# EAGLE design sanguino (EAGLE 5.00)
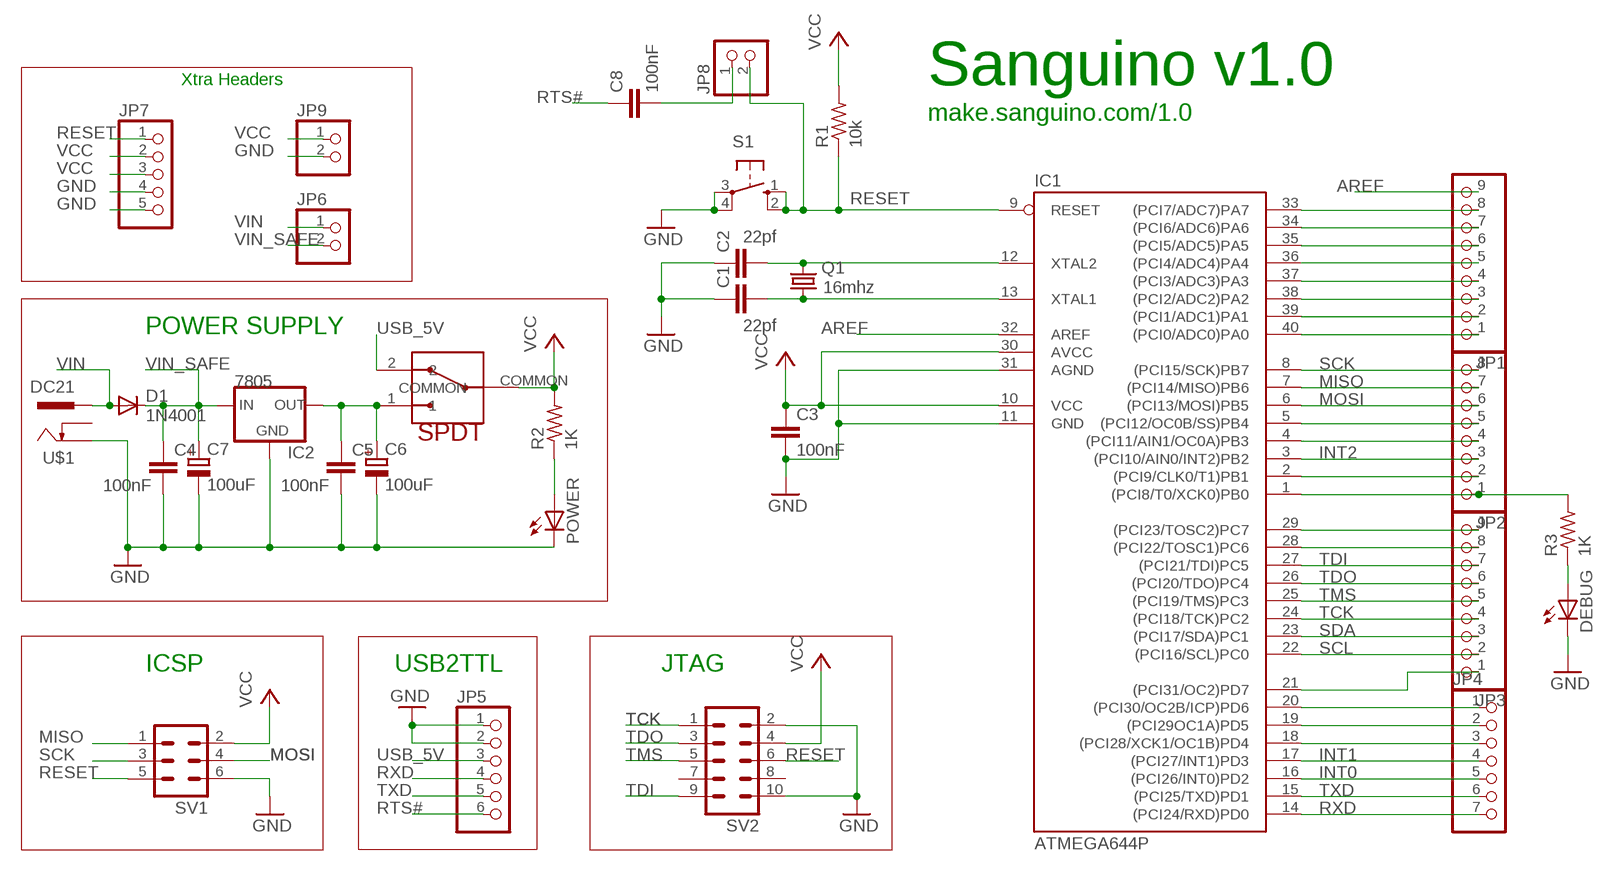
[diagram p0: schematic, sheet 1]

## Parts
C1  22pf  C-EU025-025X050  [C025-025X050]
C2  22pf  C-EU025-025X050  [C025-025X050]
C3  100nF  C-EU050-030X075  [C050-030X075]
C4  100nF  C-EU050-030X075  [C050-030X075]
C5  100nF  C-EU050-030X075  [C050-030X075]
C6  100uF  CPOL-EUE2.5-6  [E2,5-6]
C7  100uF  CPOL-EUE2.5-6  [E2,5-6]
C8  100nF  C-EU050-030X075  [C050-030X075]
D1  1N4001  1N4004  [DO41-10]
DEBUG  LED3MM  [LED3MM]
IC1  ATMEGA644P  ATMEGA644-20P  [DIL40]
IC2  7805  V_REG_78XXSINK  [TO220-IGO]
JP1  PINHD-1X9  [1X09]
JP2  PINHD-1X8  [1X08]
JP3  PINHD-1X9  [1X09]
JP4  PINHD-1X7  [1X07]
JP5  PINHD-1X6  [1X06]
JP6  PINHD-1X2  [1X02]
JP7  PINHD-1X5  [1X05]
JP8  PINHD-1X2  [1X02]
JP9  PINHD-1X2  [1X02]
POWER  LED3MM  [LED3MM]
Q1  16mhz  CRYSTALHC49S  [HC49/S]
R1  10k  R-US_0207/7  [0207/7]
R2  1K  R-US_0207/2V  [0207/2V]
R3  1K  R-US_0207/2V  [0207/2V]
S1  10-XX  [B3F-10XX]
SV1  ML6  [ML6]
SV2  ML10  [ML10]
U$1  DC21  [DCSKT]
U$2  SPDT  [10SP001]

## Nets
AREF: IC1.32(AREF) JP1.9
GND [power]: C1.1 C2.1 C3.2 C4.2 C5.2 C6.- C7.- DEBUG.K(C) IC1.11(GND) IC1.31(AGND) IC2.GND JP5.1 JP5.2 JP7.4 JP7.5 JP9.2 POWER.K(C) S1.3(P) S1.4(P1) SV1.6 SV2.2 SV2.10 U$1.2
INT0: IC1.16((PCI26/INT0)PD2) JP4.5
INT1: IC1.17((PCI27/INT1)PD3) JP4.4
INT2: IC1.3((PCI10/AIN0/INT2)PB2) JP2.3
MISO: IC1.7((PCI14/MISO)PB6) JP2.7 SV1.1
MOSI: IC1.6((PCI13/MOSI)PB5) JP2.6 SV1.4
N$1: C2.2 IC1.12(XTAL2) Q1.2
N$2: IC1.33((PCI7/ADC7)PA7) JP1.8
N$3: IC1.34((PCI6/ADC6)PA6) JP1.7
N$4: POWER.A R2.1
N$5: C1.2 IC1.13(XTAL1) Q1.1
N$6: IC1.35((PCI5/ADC5)PA5) JP1.6
N$7: DEBUG.A R3.1
N$8: IC1.37((PCI3/ADC3)PA3) JP1.4
N$9: IC1.38((PCI2/ADC2)PA2) JP1.3
N$10: IC1.39((PCI1/ADC1)PA1) JP1.2
N$11: IC1.40((PCI0/ADC0)PA0) JP1.1
N$12: IC1.5((PCI12/OC0B/SS)PB4) JP2.5
N$13: IC1.4((PCI11/AIN1/OC0A)PB3) JP2.4
N$15: IC1.2((PCI9/CLK0/T1)PB1) JP2.2
N$16: IC1.1((PCI8/T0/XCK0)PB0) JP2.1 R3.2
N$17: IC1.29((PCI23/TOSC2)PC7) JP3.9
N$18: IC1.28((PCI22/TOSC1)PC6) JP3.8
N$19: IC1.21((PCI31/OC2)PD7) JP3.1
N$20: IC1.36((PCI4/ADC4)PA4) JP1.5
N$21: C8.2 JP8.1
N$22: C5.1 C6.+ IC2.OUT U$2.1
N$26: IC1.20((PCI30/OC2B/ICP)PD6) JP4.1
N$27: IC1.19((PCI29OC1A)PD5) JP4.2
N$28: IC1.18((PCI28/XCK1/OC1B)PD4) JP4.3
RESET: IC1.9(RESET) JP7.1 JP8.2 R1.1 S1.1(S) S1.2(S1) SV1.5 SV2.6
RTS#: C8.1 JP5.6
RXD: IC1.14((PCI24/RXD)PD0) JP4.7 JP5.4
SCK: IC1.8((PCI15/SCK)PB7) JP2.8 SV1.3
SCL: IC1.22((PCI16/SCL)PC0) JP3.2
SDA: IC1.23((PCI17/SDA)PC1) JP3.3
TCK: IC1.24((PCI18/TCK)PC2) JP3.4 SV2.1
TDI: IC1.27((PCI21/TDI)PC5) JP3.7 SV2.9
TDO: IC1.26((PCI20/TDO)PC4) JP3.6 SV2.3
TMS: IC1.25((PCI19/TMS)PC3) JP3.5 SV2.5
TXD: IC1.15((PCI25/TXD)PD1) JP4.6 JP5.5
USB_5V: JP5.3 U$2.2
VCC [power]: C3.1 IC1.10(VCC) IC1.30(AVCC) JP7.2 JP7.3 JP9.1 R1.2 R2.2 SV1.2 SV2.4 U$2.COMMON
VIN [power]: D1.A JP6.1 U$1.1
VIN_SAFE [power]: C4.1 C7.+ D1.C IC2.IN JP6.2
Unconnected: SV2.7 SV2.8 U$1.3

## Notes on the sheet
- Xtra Headers | Sanguino v1.0
- make.sanguino.com/1.0
- POWER SUPPLY
- ICSP | USB2TTL | JTAG

## Library data of the parts
C1-C5 C8 = rcl:C-EU: CAPACITOR, European symbol
C6 C7 = rcl:CPOL-EU: POLARIZED CAPACITOR, European symbol
D1 = diode:1N4004: DIODE general purpose rectifier, 1 A
DEBUG POWER = led:LED: LED OSRAM: - CHIPLED LG R971, LG N971, LY N971, LG Q971, LY Q971, LO R971, LY R971 LH N974, LH R974 LS Q976, LO Q976, LY Q976 LO Q996 - Hyper CHIPLED LW Q18S LB Q993, LB Q99A, LB R99A - SideLED LS A670, LO A670, LY A670, LG A670, LP A670 LB A673, LV A673, LT A673, LW A673 LH A674 LY A675 LS A676, LA A676, LO A676, LY A676, LW A676 LS A679, LY A679, LG A679 - Hyper Micro SIDELED® LS Y876, LA Y876, LO Y876, LY Y876 LT Y87S - SmartLED LW L88C, LW L88S LB L89C, LB L89S, LG L890 LS L89K, LO L89K, LY L89K LS L896, LA L896, LO L896, LY L896 - TOPLED LS T670, LO T670, LY T670, LG T670, LP T670 LSG T670, LSP T670, LSY T670, LOP T670, LYG T670 LG T671, LOG T671, LSG T671 LB T673, LV T673, LT T673, LW T673 LH T674 LS T676, LA T676, LO T676, LY T676, LB T676, LH T676, LSB T676, LW T676 LB T67C, LV T67C, LT T67C, LS T67K, LO T67K, LY T67K, LW E67C LS E67B, LA E67B, LO E67B, LY E67B, LB E67C, LV E67C, LT E67C LW T67C LS T679, LY T679, LG T679 LS T770, LO T770, LY T770, LG T770, LP T770 LB T773, LV T773, LT T773, LW T773 LH T774 LS E675, LA E675, LY E675, LS T675 LS T776, LA T776, LO T776, LY T776, LB T776 LHGB T686 LT T68C, LB T68C - Hyper Mini TOPLED® LB M676 - Mini TOPLED Santana® LG M470 LS M47K, LO M47K, LY M47K Source: http://www.osram.convergy.de - LUMILED® LXK2-PW12-R00, LXK2-PW12-S00, LXK2-PW14-U00, LXK2-PW14-V00 LXK2-PM12-R00, LXK2-PM12-S00, LXK2-PM14-U00 LXK2-PE12-Q00, LXK2-PE12-R00, LXK2-PE12-S00, LXK2-PE14-T00, LXK2-PE14-U00 LXK2-PB12-K00, LXK2-PB12-L00, LXK2-PB12-M00, LXK2-PB14-N00, LXK2-PB14-P00, LXK2-PB14-Q00 LXK2-PR12-L00, LXK2-PR12-M00, LXK2-PR14-Q00, LXK2-PR14-R00 LXK2-PD12-Q00, LXK2-PD12-R00, LXK2-PD12-S00 LXK2-PH12-R00, LXK2-PH12-S00 LXK2-PL12-P00, LXK2-PL12-Q00, LXK2-PL12-R00 Source: www.luxeon.com
IC1 = avr:ATMEGA644*P: MICROCONTROLLER 64 kBytes FLASH 4 kBytes SRAM 2 kBytes EEPROM DUAL USART 8-channel 10 bit ADC
IC2 = SparkFun:V_REG_78XX: Voltage Regulator Standard 7805 5V regulator. IGO (Input Ground Output). Spark Fun Electronics SKU : COM-00107
JP1 JP3 = pinhead:PINHD-1X9: PIN HEADER
JP2 = pinhead:PINHD-1X8: PIN HEADER
JP4 = pinhead:PINHD-1X7: PIN HEADER
JP5 = pinhead:PINHD-1X6: PIN HEADER
JP6 JP8 JP9 = pinhead:PINHD-1X2: PIN HEADER
JP7 = pinhead:PINHD-1X5: PIN HEADER
Q1 = crystal:CRYSTAL: CRYSTAL
R1 R2 = rcl:R-US_: RESISTOR, American symbol
R3 = resistor:R-US_: RESISTOR, American symbol
S1 = switch-omron:10-XX: OMRON SWITCH
SV1 = con-harting-ml:ML6: HARTING
SV2 = con-harting-ml:ML10: HARTING
U$1 = dcsocket:DC21: DC 2.1 mm Power Socket Negative Centre
U$2 = nycr:SPDT

## Net classes
0 default: width 0.635 mm, clearance 0.406 mm
1 power: width 0.635 mm, clearance 0.406 mm

## Board
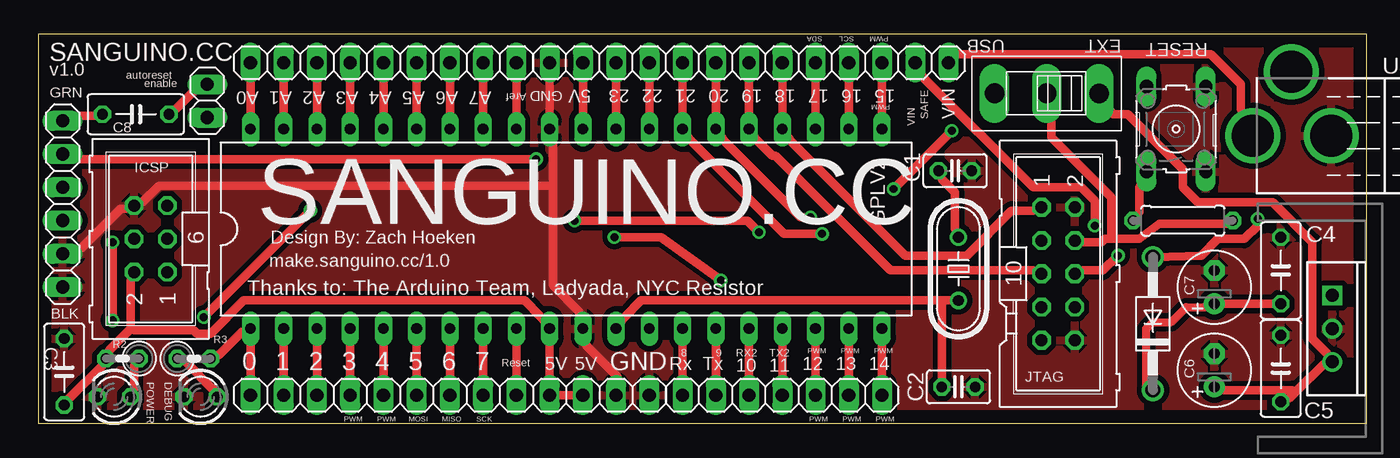
[diagram p1: board, top side]
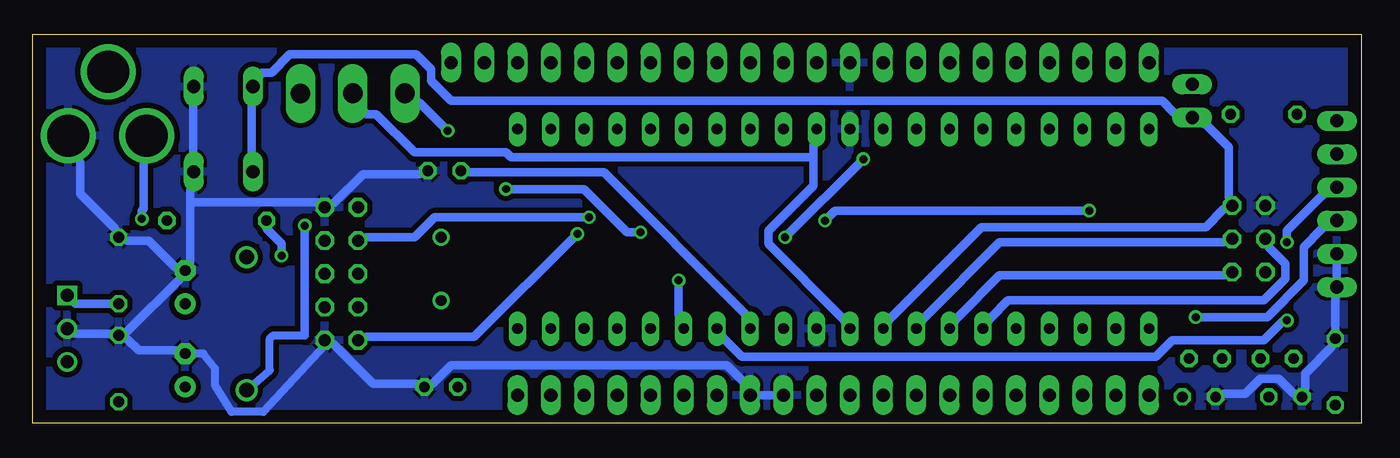
[diagram p2: board, bottom side, seen from below]

Size 101.52 x 29.71 mm. Coordinates in mm from the lower left corner, seen from the top.
Outline: 0,0 101.52,0 101.52,29.71 0,29.71 0,0
Copper layers (1*16): Top 0.035mm / dielectric 1.5mm / Bottom 0.035mm
Design rules "default *": minimum track width 10mil, minimum drill 24mil, track to track 10mil, track to pad 10mil, pad to pad 10mil, via to via 10mil, smd to smd 10mil, copper to edge 40mil, drill to drill 8mil, minimum pad ring 10mil, minimum via ring 8mil, stop-mask expansion 4mil, vias tented up to drill 0mil, thermal gap 10mil

### Footprints (pad centres in the part's own frame; a part is rotated, then mirrored left to right if it is on the bottom)
C025-025X050 = drill 0.813 octagon: 1 -1.27,0; 2 1.27,0
C050-030X075 = drill 0.813 octagon: 1 -2.54,0; 2 2.54,0
E2,5-6 = drill 0.813 pad 1.6 round: + -1.27,0 | drill 0.813 pad 1.6 octagon: - 1.27,0
DO41-10 = drill 1.118 round: A 5.08,0; C -5.08,0
LED3MM = drill 0.813 octagon: A -1.27,0; K 1.27,0
DIL40 = drill 0.813 long: 1 -24.13,-7.62; 2 -21.59,-7.62; 3 -19.05,-7.62; 4 -16.51,-7.62; 5 -13.97,-7.62; 6 -11.43,-7.62; 7 -8.89,-7.62; 8 -6.35,-7.62; 9 -3.81,-7.62; 10 -1.27,-7.62; 11 1.27,-7.62; 12 3.81,-7.62; 13 6.35,-7.62; 14 8.89,-7.62; 15 11.43,-7.62; 16 13.97,-7.62; 17 16.51,-7.62; 18 19.05,-7.62; 19 21.59,-7.62; 20 24.13,-7.62; 21 24.13,7.62; 22 21.59,7.62; 23 19.05,7.62; 24 16.51,7.62; 25 13.97,7.62; 26 11.43,7.62; 27 8.89,7.62; 28 6.35,7.62; 29 3.81,7.62; 30 1.27,7.62; 31 -1.27,7.62; 32 -3.81,7.62; 33 -6.35,7.62; 34 -8.89,7.62; 35 -11.43,7.62; 36 -13.97,7.62; 37 -16.51,7.62; 38 -19.05,7.62; 39 -21.59,7.62; 40 -24.13,7.62
TO220-IGO = drill 1 round: GND 0,0; OUT 2.54,0 | drill 1 square: IN -2.54,0
1X09 = drill 1.016 long: 1 -10.16,0; 2 -7.62,0; 3 -5.08,0; 4 -2.54,0; 5 0,0; 6 2.54,0; 7 5.08,0; 8 7.62,0; 9 10.16,0
1X08 = drill 1.016 long: 1 -8.89,0; 2 -6.35,0; 3 -3.81,0; 4 -1.27,0; 5 1.27,0; 6 3.81,0; 7 6.35,0; 8 8.89,0
1X07 = drill 1.016 long: 1 -7.62,0; 2 -5.08,0; 3 -2.54,0; 4 0,0; 5 2.54,0; 6 5.08,0; 7 7.62,0
1X06 = drill 1.016 long: 1 -6.35,0; 2 -3.81,0; 3 -1.27,0; 4 1.27,0; 5 3.81,0; 6 6.35,0
1X02 = drill 1.016 long: 1 -1.27,0; 2 1.27,0
1X05 = drill 1.016 long: 1 -5.08,0; 2 -2.54,0; 3 0,0; 4 2.54,0; 5 5.08,0
HC49/S = drill 0.813 round: 1 -2.413,0; 2 2.413,0
0207/7 = drill 0.813 octagon: 1 -3.81,0; 2 3.81,0
0207/2V = drill 0.813 octagon: 1 -1.27,0; 2 1.27,0
B3F-10XX = drill 1.016 long: 1 -3.251,2.261; 2 3.251,2.261; 3 -3.251,-2.261; 4 3.251,-2.261
ML6 = drill 0.914 octagon: 1 -2.54,-1.27; 2 -2.54,1.27; 3 0,-1.27; 4 0,1.27; 5 2.54,-1.27; 6 2.54,1.27
ML10 = drill 0.914 octagon: 1 -5.08,-1.27; 2 -5.08,1.27; 3 -2.54,-1.27; 4 -2.54,1.27; 5 0,-1.27; 6 0,1.27; 7 2.54,-1.27; 8 2.54,1.27; 9 5.08,-1.27; 10 5.08,1.27
DCSKT = drill 3.2 round: 1 0,6.08; 2 0,0.08; 3 4.9,3.13
10SP001 = drill 1.5 long: 1 1.71,2.86; 2 9.69,2.85; COMMON 5.7,2.85

### Placement (x,y rotation side)
C1  70.07,19.3 180 top
C2  70.32,2.79 180 top
C3  1.99,3.93 90 top
C4  94.96,11.68 90 top
C5  94.96,4.19 90 top
C6  89.88,4.06 90 top
C7  89.88,10.41 90 top
C8  7.46,23.62 0 top
D1  85.18,7.62 90 top
DEBUG  12.41,2.03 180 top
IC1  40.35,14.85 0 top
IC2  98.89,7.23 270 top
JP1  26.38,27.55 0 top
JP2  25.11,2.15 0 top
JP3  54.32,27.55 180 top
JP4  56.86,2.15 180 top
JP5  1.87,16.76 90 top
JP6  68.29,27.55 180 top
JP7  41.62,2.15 0 top
JP8  12.92,24.63 270 top
JP9  40.35,27.55 180 top
POWER  5.8,2.03 180 top
Q1  70.32,11.81 270 top
R1  87.46,15.49 0 top
R2  6.44,4.95 180 top
R3  11.9,4.95 0 top
S1  86.96,22.47 90 top
SV1  8.6,14.09 90 top
SV2  77.94,11.43 270 top
U$1  98.89,21.97 90 top
U$2  82.77,28.06 180 top

### Tracks (layer width: path | path; a pad name or v marks a point on that pad's centre or on a via)
AREF
  Top 0.635: IC1.32 JP1.9
GND
  Top 0.635: JP5.2 3.26,13.33 6.31,16.38 6.69,16.38 SV1.6 7.96,16.89 9.23,18.16 39.33,18.16 | JP9.2 IC1.31 39.33,21.2 39.33,18.16 | JP7.4 44.29,3.55 41.87,5.96 IC1.11 41.36,8.5 39.33,10.54 39.33,18.16
  Bottom 0.61: SV2.10 79.21,5.96 83.91,0.88 86.32,0.88 87.59,2.92 87.59,4.19 88.48,5.33 C6.-
  Bottom 0.635: SV2.10 78.57,6.09 75.53,3.04 72.22,3.04 C2.1 70.95,3.04 69.56,4.44 48.48,4.44 47.33,3.3 JP7.5 JP7.4 | C5.2 95.59,6.85 98.26,6.85 IC2.GND | C6.- 90.64,5.58 93.43,5.58 94.32,6.47 C5.2 | C1.1 71.97,19.05 76.29,19.05 78.57,16.76 SV2.2 79.72,16.89 89.5,16.89 | S1.4 89.24,24.25 89.24,20.7 S1.3 89.5,17.77 89.5,16.89 | C7.- 90.64,11.93 92.67,13.97 94.32,13.97 C4.2 95.21,14.85 97.88,17.52 97.88,19.93 U$1.2 | 89.5,16.89 89.5,12.31 C7.- | C5.2 94.32,6.98 90.26,11.04 C7.- | DEBUG.K 10.5,2.28 8.85,2.28 7.71,3.42 6.31,3.42 5.17,2.28 POWER.K 4.28,2.66 4.28,3.8 2.25,5.84 C3.2 1.99,9.77 JP5.1 JP5.2
  pour Bottom: -1.18,30.86 104.48,30.86 104.48,-1.78 -1.18,-1.78
  pour Top: -1.05,31.24 103.59,31.24 103.59,-2.67 -1.05,-2.67
INT0
  Top 0.635: JP4.5 IC1.16
INT1
  Top 0.635: JP4.4 IC1.17
INT2
  Top 0.635: JP2.3 IC1.3
MISO
  Top 0.635: IC1.7 JP2.7
  Bottom 0.635: SV1.1 10.5,11.3 27.65,11.3 30.82,8.12 IC1.7
MOSI
  Top 0.635: IC1.6 JP2.6
  Bottom 0.635: SV1.4 7.07,13.46 5.8,12.19 5.8,11.04 7.46,9.39 27.01,9.39 28.28,8.12 IC1.6
N$1
  Top 0.635: 69.05,9.39 46.06,9.39 44.79,8.12 IC1.12 | 69.05,9.39 Q1.2 | 69.05,9.39 C2.2
N$2
  Top 0.635: IC1.33 JP1.8
N$3
  Top 0.635: IC1.34 JP1.7
N$4
  Top 0.635: POWER.A 7.33,2.66 7.33,4.44 R2.1
N$5
  Top 0.635: Q1.1 70.07,14.85 70.07,17.65 69.05,18.66 C1.2
  Bottom 0.635: IC1.13 47.08,8.38 57.87,19.17 68.16,19.17 C1.2
N$6
  Top 0.635: IC1.35 JP1.6
N$7
  Top 0.635: R3.1 11.27,4.69 13.42,2.54 DEBUG.A
N$8
  Top 0.635: IC1.37 JP1.4
N$9
  Top 0.635: IC1.38 JP1.3
N$10
  Top 0.635: IC1.39 JP1.2
N$11
  Top 0.635: IC1.40 JP1.1
N$12
  Top 0.635: JP2.5 IC1.5
N$13
  Top 0.635: JP2.4 IC1.4
N$15
  Top 0.635: JP2.2 IC1.2
N$16
  Top 0.635: R3.2 13.8,5.2 15.58,6.98 IC1.1 JP2.1
N$17
  Top 0.635: IC1.29 JP3.9
N$18
  Top 0.635: IC1.28 JP3.8
N$19
  Top 0.635: IC1.21 JP3.1
N$20
  Top 0.635: IC1.36 JP1.5
N$21
  Top 0.635: C8.2 10.5,24 11.77,25.27 JP8.1
N$22
  Top 0.635: 96.04,2.34 98.26,4.57 IC2.OUT 98.51,5.33 97.37,6.47 97.37,13.84 94.32,16.89 88.61,16.89 87.46,18.03 87.46,19.43 83.27,23.62 82.13,23.62 U$2.1 | 96.04,2.34 95.59,1.9 C5.1 | C6.+ 90.64,2.54 95.85,2.54 96.04,2.34
N$26
  Top 0.635: JP4.1 IC1.20
N$27
  Top 0.635: JP4.2 IC1.19
N$28
  Top 0.635: JP4.3 IC1.18
RESET  (via drill 0.61)
  Top 0.635: R1.1 84.16,16.12 84.16,18.03 S1.1 | v82.51,12.82 81.37,11.68 79.84,11.68 SV2.6 | IC1.9 JP7.1
  Bottom 0.635: v82.51,12.82 82.51,13.71 83.66,14.85 R1.1 | S1.1 84.8,20.7 84.8,24.25 S1.2 84.04,26.79 83.27,26.79 81.88,28.19 72.22,28.19 71.08,27.05 71.08,26.16 69.56,24.63 15.2,24.63 14.31,23.74 JP8.2 11.77,22.73 10.12,21.08 10.12,17.27 SV1.5 10.5,16.38 11.9,14.98 29.05,14.98 35.9,8.12 IC1.9
RTS#
  Top 0.635: C8.1 4.28,23.49 3.26,23.49 JP5.6
RXD  (via drill 0.61)
  Top 0.635: IC1.14 JP4.7 | v5.68,7.87 v5.68,13.84
  Bottom 0.635: v5.68,13.84 5.68,14.73 3.01,17.39 JP5.4 | v5.68,7.87 5.93,7.87 7.46,6.35 14.44,6.35 15.71,5.08 47.33,5.08 48.6,6.35 IC1.14
SCK
  Top 0.635: IC1.8 JP2.8
  Bottom 0.635: SV1.3 10.5,13.84 27.65,13.84 33.36,8.12 IC1.8
SCL
  Top 0.635: IC1.22 JP3.2
SDA
  Top 0.635: IC1.23 JP3.3
TCK
  Top 0.635: JP3.4 IC1.24 57.49,21.59 66.26,12.82 70.95,12.82 74.38,16.25 76.03,16.25 SV2.1
TDI  (via drill 0.61)
  Top 0.635: JP3.7 IC1.27 49.87,21.59 56.98,14.47 v59.91,14.47
  Bottom 0.635: v59.91,14.47 67.78,6.6 76.03,6.6 SV2.9
TDO  (via drill 0.61)
  Top 0.635: JP3.6 IC1.26 52.41,21.59 58.26,15.74 v59.02,15.74
  Bottom 0.635: v59.02,15.74 70.83,15.74 72.35,14.22 76.03,14.22 SV2.3
TMS
  Top 0.635: JP3.5 IC1.25 54.95,21.59 56.1,20.44 56.35,20.44 65.11,11.68 76.03,11.68 SV2.5
TXD  (via drill 0.61)
  Top 0.635: IC1.15 JP4.6 | v38.06,20.19 3.26,20.19 JP5.5 | v44.03,14.22 47.59,14.22 v52.16,10.92
  Bottom 0.635: v38.06,20.19 v44.03,14.22 | v52.16,10.92 52.16,8.38 IC1.15
USB_5V  (via drill 0.61)
  Top 0.635: v12.66,8.12 v20.79,16.25 | v40.98,15.49 54.19,15.49 v55.08,14.6 | v65.37,17.9 v69.81,22.35
  Bottom 0.635: v12.66,8.12 7.2,8.12 4.41,10.92 4.41,13.46 3.01,14.85 JP5.3 | v20.79,16.25 40.22,16.25 v40.98,15.49 | v55.08,14.6 56.1,14.6 59.4,17.9 v65.37,17.9 | v69.81,22.35 71.97,24.51 U$2.2
VCC
  Top 0.635: 82,14.09 81.5,14.09 81.24,13.84 79.84,13.84 SV2.4 | 82,14.09 84.16,14.09 85.69,15.24 90.89,15.24 R1.2 | U$2.COMMON 77.43,22.98 77.43,21.84 82,17.27 82,14.09 | C3.1 2.38,1.9 4.92,4.44 R2.2 5.42,5.58 7.07,7.23 | 7.07,7.23 7.07,10.92 SV1.2 | IC1.30 JP9.1 | JP7.3 JP7.2 IC1.10 38.44,8.12 37.17,9.39 15.71,9.39 13.17,6.85 12.15,6.85 11.9,7.11 7.33,7.11 7.07,7.23
  Bottom 0.635: 41.87,20.31 41.87,18.16 45.3,14.73 45.3,13.71 39.71,8.12 IC1.10 | 41.87,20.31 41.87,21.2 IC1.30 | U$2.COMMON 76.03,23.62 75.27,23.62 72.35,20.7 65.37,20.7 64.99,20.31 41.87,20.31
VIN  (via drill 0.61)
  Top 0.635: JP6.1 70.19,28.19 89.62,28.19 91.91,25.9 91.91,24 U$1.1 | v93.18,15.62 93.18,15.11 92.16,14.09 90.13,14.09 88.86,12.82 D1.A
  Bottom 0.635: v93.18,15.62 93.18,16.25 93.05,16.38 93.05,19.93 U$1.1
VIN_SAFE  (via drill 0.61)
  Top 0.61: 89.12,8.88 87.72,8.88 86.58,7.74 85.18,7.74 84.67,7.23 84.67,2.92 84.8,2.79 D1.C
  Top 0.635: C4.1 C7.+ 89.12,8.88 | v80.73,15.11 80.73,17.01 79.72,18.03 76.03,18.03 67.65,26.41 JP6.2
  Bottom 0.61: 80.73,6.73 83.15,6.73 83.4,6.47 83.4,4.06 D1.C
  Bottom 0.635: C4.1 98.26,9.14 IC2.IN | 80.73,6.73 v80.73,15.11

### Text on the board
tPlace: SDA | SCL | PWM | USB | EXT | RESET | SANGUINO.CC | v1.0 | autoreset | enable | A0 | A1 | A2 | A3 | A4 | A5 | A6 | A7 | GND | 5V | 23 | 22 | 21 | 20 | 19 | 18 | 17 | 16 | 15 | GRN | Aref | PWM | VIN | SAFE | VIN | ICSP | SANGUINO.CC | GPLV2 | Design By: Zach Hoeken | make.sanguino.cc/1.0 | Thanks to: The Arduino Team, Ladyada, NYC Resistor | BLK | C3 | PWM | PWM | PWM | Reset | 8 | 9 | RX2 | TX2 | 0 | 1 | 2 | 3 | 4 | 5 | 6 | 7 | 5V | 5V | GND | Rx | Tx | 10 | 11 | 12 | 13 | 14 | JTAG | PWM | PWM | MOSI | MISO | SCK | PWM | PWM | PWM